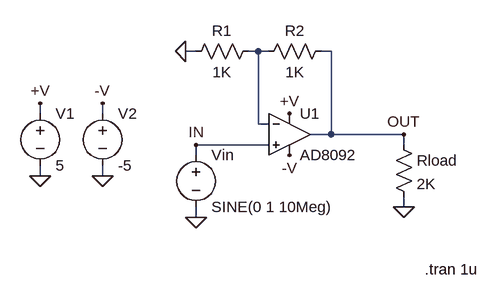
[diagram p0: schematic AD8092.asc]
AD8092.asc, the LTspice schematic file:
Version 4
SHEET 1 1240 700
WIRE 400 -1184 384 -1184
WIRE 496 -1184 480 -1184
WIRE 512 -1184 496 -1184
WIRE 608 -1184 592 -1184
WIRE 160 -1088 160 -1104
WIRE 256 -1088 256 -1104
WIRE 496 -1072 496 -1184
WIRE 512 -1072 496 -1072
WIRE 608 -1056 608 -1184
WIRE 608 -1056 576 -1056
WIRE 720 -1056 608 -1056
WIRE 512 -1040 400 -1040
WIRE 720 -1040 720 -1056
WIRE 400 -1024 400 -1040
WIRE 160 -992 160 -1008
WIRE 256 -992 256 -1008
WIRE 720 -944 720 -960
WIRE 400 -928 400 -944
FLAG 400 -928 0
FLAG 720 -1056 OUT
FLAG 400 -1040 IN
FLAG 544 -1088 +V
FLAG 544 -1024 -V
FLAG 384 -1184 0
FLAG 720 -944 0
FLAG 160 -1104 +V
FLAG 160 -992 0
FLAG 256 -1104 -V
FLAG 256 -992 0
SYMBOL Opamps\\AD8092 544 -1120 R0
SYMATTR InstName U1
SYMBOL voltage 400 -1040 R0
WINDOW 123 24 146 Left 2
WINDOW 39 24 125 Left 2
SYMATTR InstName Vin
SYMATTR Value SINE(0 1 10Meg)
SYMBOL res 496 -1200 R90
WINDOW 0 0 56 VBottom 2
WINDOW 3 32 56 VTop 2
SYMATTR InstName R1
SYMATTR Value 1K
SYMBOL res 608 -1200 R90
WINDOW 0 0 56 VBottom 2
WINDOW 3 32 56 VTop 2
SYMATTR InstName R2
SYMATTR Value 1K
SYMBOL res 704 -1056 R0
SYMATTR InstName Rload
SYMATTR Value 2K
SYMBOL voltage 160 -1104 R0
WINDOW 123 0 0 Left 2
WINDOW 39 0 0 Left 2
SYMATTR InstName V1
SYMATTR Value 5
SYMBOL voltage 256 -1104 R0
WINDOW 123 24 146 Left 2
WINDOW 39 24 125 Left 2
SYMATTR InstName V2
SYMATTR Value -5
TEXT 752 -848 Left 2 !.tran 1u

The netlist it stands for:
* AD8092.asc
XU1 IN N001 +V -V OUT AD8092  ; pins In+ In- V+ V- OUT
Vin IN 0 SINE(0 1 10Meg)
R1 N001 0 1K
R2 OUT N001 1K
Rload OUT 0 2K
V1 +V 0 5
V2 -V 0 -5
.tran 1u
.backanno
.end